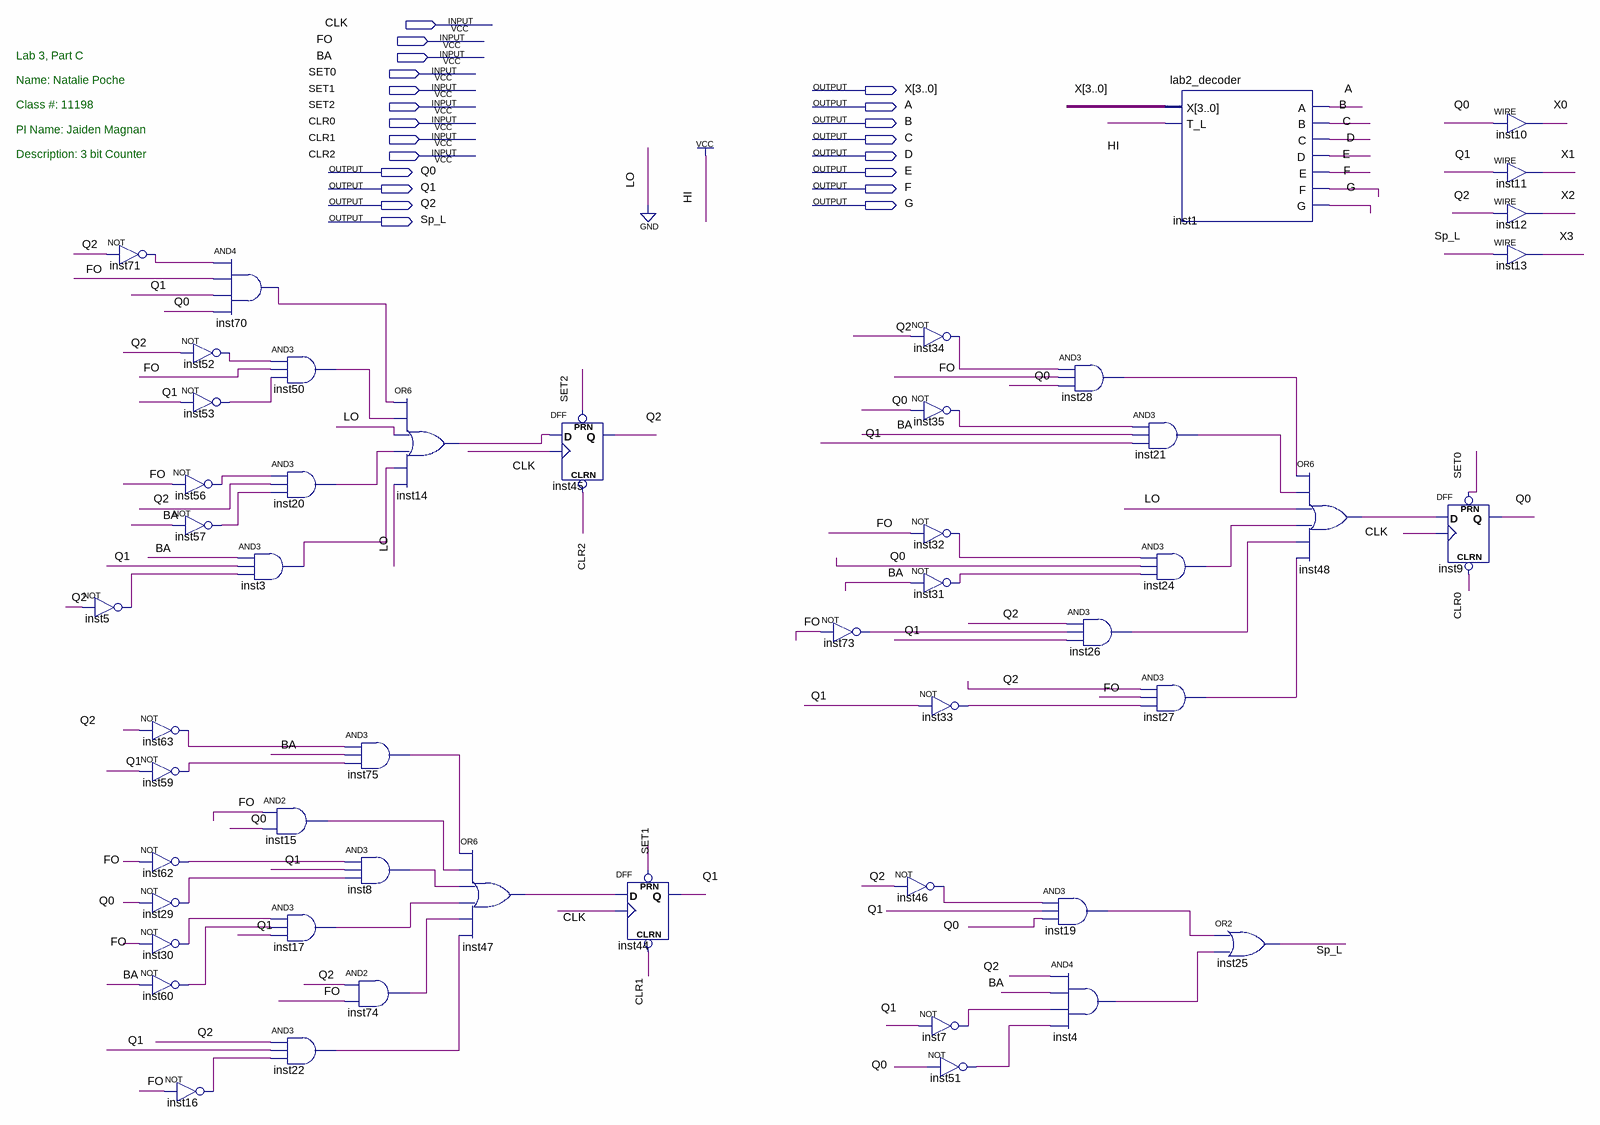
[diagram p0: schematic sheet]
// Quartus schematic lab3.bdf as structural Verilog: 51 symbols, 21 pins
module lab3 (
  input  CLK,
  input  FO,
  input  BA,
  input  SET0,
  input  SET1,
  input  SET2,
  input  CLR0,
  input  CLR1,
  input  CLR2,
  output [3:0] X,
  output A,
  output B,
  output C,
  output D,
  output Q0,
  output E,
  output Q1,
  output F,
  output Q2,
  output G,
  output Sp_L
);

  wire inst3_out, inst4_out, inst5_out, inst7_out, inst8_out, inst14_out, inst15_out, inst16_out, inst17_out,
       inst19_out, inst20_out, inst21_out, inst22_out, inst24_out, inst26_out, inst27_out, inst28_out,
       inst29_out, inst30_out, inst31_out, inst32_out, inst33_out, inst34_out, inst35_out, inst46_out,
       inst47_out, inst48_out, inst50_out, inst51_out, inst52_out, inst53_out, inst56_out, inst57_out,
       inst59_out, inst60_out, inst62_out, inst63_out, inst70_out, inst71_out, inst73_out, inst74_out,
       inst75_out;

  not inst71 (inst71_out, Q2);
  not inst5 (inst5_out, Q2);
  not inst52 (inst52_out, Q2);
  not inst53 (inst53_out, Q1);
  not inst56 (inst56_out, FO);
  not inst57 (inst57_out, BA);
  not inst63 (inst63_out, Q2);
  not inst59 (inst59_out, Q1);
  not inst62 (inst62_out, FO);
  not inst29 (inst29_out, Q0);
  not inst30 (inst30_out, FO);
  not inst60 (inst60_out, BA);
  not inst16 (inst16_out, FO);
  and inst70 (inst70_out, inst71_out, FO, Q1, Q0);
  and inst3 (inst3_out, BA, Q1, inst5_out);
  and inst15 (inst15_out, FO, Q0);
  and inst50 (inst50_out, inst52_out, FO, inst53_out);
  and inst20 (inst20_out, inst56_out, Q2, inst57_out);
  and inst17 (inst17_out, inst30_out, inst60_out, Q1);
  and inst22 (inst22_out, Q2, Q1, inst16_out);
  or inst14 (inst14_out, inst70_out, inst50_out, 1'b0, inst20_out, inst3_out, 1'b0);
  and inst75 (inst75_out, inst63_out, BA, inst59_out);
  and inst8 (inst8_out, inst62_out, Q1, inst29_out);
  and inst74 (inst74_out, Q2, FO);
  or inst47 (inst47_out, inst75_out, inst15_out, inst8_out, inst17_out, inst74_out, inst22_out);
  DFF inst45 (.CLRN(CLR2), .CLK(CLK), .D(inst14_out), .PRN(SET2), .Q(Q2));
  DFF inst44 (.CLRN(CLR1), .CLK(CLK), .D(inst47_out), .PRN(SET1), .Q(Q1));
  not inst73 (inst73_out, FO);
  not inst34 (inst34_out, Q2);
  not inst35 (inst35_out, Q0);
  not inst32 (inst32_out, FO);
  not inst31 (inst31_out, BA);
  not inst33 (inst33_out, Q1);
  not inst46 (inst46_out, Q2);
  not inst7 (inst7_out, Q1);
  not inst51 (inst51_out, Q0);
  and inst19 (inst19_out, inst46_out, Q1, Q0);
  and inst4 (inst4_out, Q2, BA, inst7_out, inst51_out);
  and inst28 (inst28_out, inst34_out, FO, Q0);
  and inst26 (inst26_out, Q2, inst73_out, Q1);
  lab2_decoder inst1 (.X(X), .T_L(1'b1), .A(A), .B(B), .C(C), .D(D), .E(E), .F(F), .G(G));
  and inst21 (inst21_out, inst35_out, BA, Q1);
  and inst24 (inst24_out, inst32_out, Q0, inst31_out);
  and inst27 (inst27_out, Q2, FO, inst33_out);
  or inst25 (Sp_L, inst19_out, inst4_out);
  or inst48 (inst48_out, inst28_out, inst21_out, 1'b0, inst24_out, inst26_out, inst27_out);
  DFF inst9 (.CLRN(CLR0), .CLK(CLK), .D(inst48_out), .PRN(SET0), .Q(Q0));
  assign X[0] = Q0;  // WIRE inst10
  assign X[1] = Q1;  // WIRE inst11
  assign X[2] = Q2;  // WIRE inst12
  assign X[3] = Sp_L;  // WIRE inst13

  // Notes on the sheet:
  //   Lab 3, Part C
  //   Name: Natalie Poche
  //   Class #: 11198
  //   PI Name: Jaiden Magnan
  //   Description: 3 bit Counter
endmodule
